# Altium schematic sheet oximonitor.SchDoc
size A; SheetNumber: 1; SheetTotal: 1
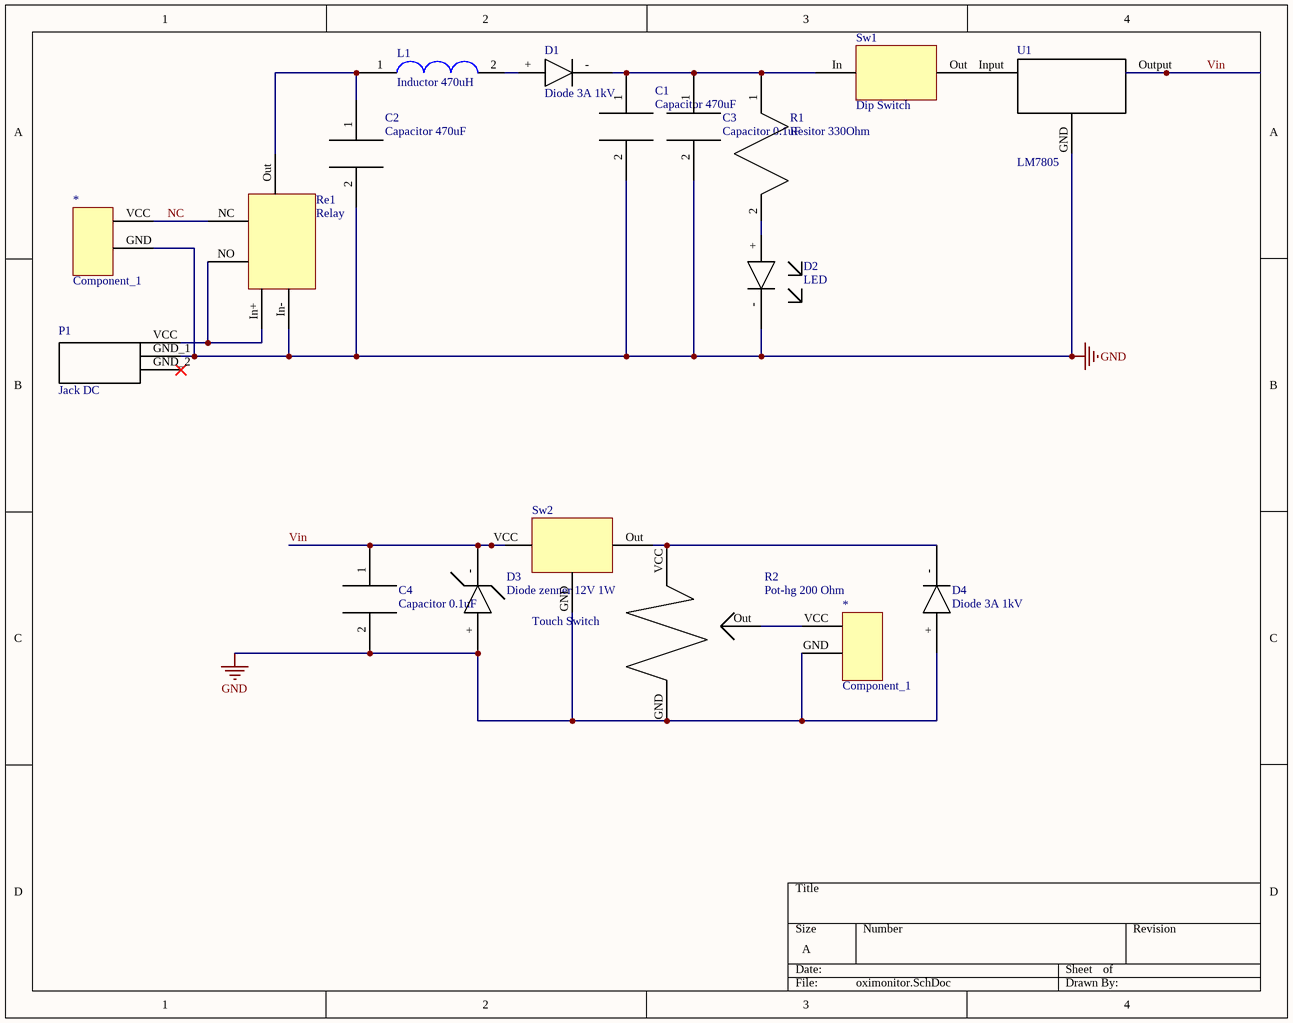
[diagram p0: oximonitor.SchDoc]

## Parts
(Parts that share a designator on the sheet are numbered #1, #2 ... from top to bottom, then left to right.)
*#1  Component_1  [Header 2]
*#2  Component_1  [Header 2]
C1  Capacitor 470uF  [Capacitor SMD 470uF 16V]
C2  Capacitor 470uF  [Capacitor SMD 470uF 16V]
C3  Capacitor 0.1uF  [Capacitor 0603 0.1uF]
C4  Capacitor 0.1uF  [Capacitor 0603 0.1uF]
D1  Diode 3A 1kV  [Diode 3A - 1kV (SMD)]
D2  LED  [oximonitor led]
D3  Diode zenner 12V 1W  [Diode_zenner12V_1W]
D4  Diode 3A 1kV  [Diode 3A - 1kV (SMD)]
L1  Inductor 470uH  [Inductor 470uH]
P1  Jack DC  [Jack DC]
R1  Resitor 330Ohm  [Resistor 0805]
R2  Pot-hg 200 Ohm  [Pot-hg resistor 220 Ohm]
Re1  Relay  [Relay 12VDC]
Sw1  Dip Switch  [Dip Switch]
Sw2  Touch Switch  [Touch Switch]
U1  LM7805  [LM7805]

## Nets
GND: *#1.GND *#2.GND C1.2 C2.2 C3.2 C4.2 D2.- D3.+ D4.+ P1.GND_1 R2.GND Re1.In- Sw2.GND U1.GND
NC: *#1.VCC Re1.NC
Vin: C4.1 D3.- Sw2.VCC U1.Output
Net*#2_VCC: *#2.VCC R2.Out
NetC1_1: C1.1 C3.1 D1.- R1.1 Sw1.In
NetC2_1: C2.1 L1.1 Re1.Out
NetD1_+: D1.+ L1.2
NetD2_+: D2.+ R1.2
NetD4_-: D4.- R2.VCC Sw2.Out
NetP1_VCC: P1.VCC Re1.In+ Re1.NO
NetSw1_Out: Sw1.Out U1.Input

Not connected (* = marked no-connect by the designer): P1 GND_2*

## Library data of the parts
C3 C4 = Capacitor 0.1uF: Model Samsung 0603. Capacitance 0.1uF
D1 D4 = Diode 3A 1kV: https://www.thegioiic.com/1n5408-s3m-smb-diode-chinh-luu-3a-1kv
D2 = LED: LED 0805
D3 = Diode zenner 12V 1W: https://www.thegioiic.com/zm4742a-gs08-diode-zener-12v-1w-smd
P1 = Jack DC: https://www.thegioiic.com/dc5525-dau-noi-nguon-dc-cai-5525-han-pcb-kim-2-5mm
R1 = Resitor 330Ohm: https://www.thegioiic.com/dien-tro-330-ohm-0805-5-
R2 = Pot-hg 200 Ohm: https://www.thegioiic.com/3362w-201-bien-tro-200-ohm-3-chan-tinh-chinh-ngang-0-25w
Re1 = Relay: https://nshopvn.com/product/relay-12vdc-10a/?variant=99218
Sw1 = Dip Switch: https://www.thegioiic.com/cong-tac-1-bit-dip-switch-xuyen-lo-2-54mm-mau-do
Sw2 = Touch Switch: https://www.thegioiic.com/ttp223-phim-cam-ung-dien-dung-1-kenh-v3
U1 = LM7805: https://www.thegioiic.com/lm7805ct-cn-ic-on-ap-5v-1-5a